# Altium schematic sheet PushButtonBlack.SchDoc
size B; DocumentNumber: 5; SheetNumber: 5; SheetTotal: 6
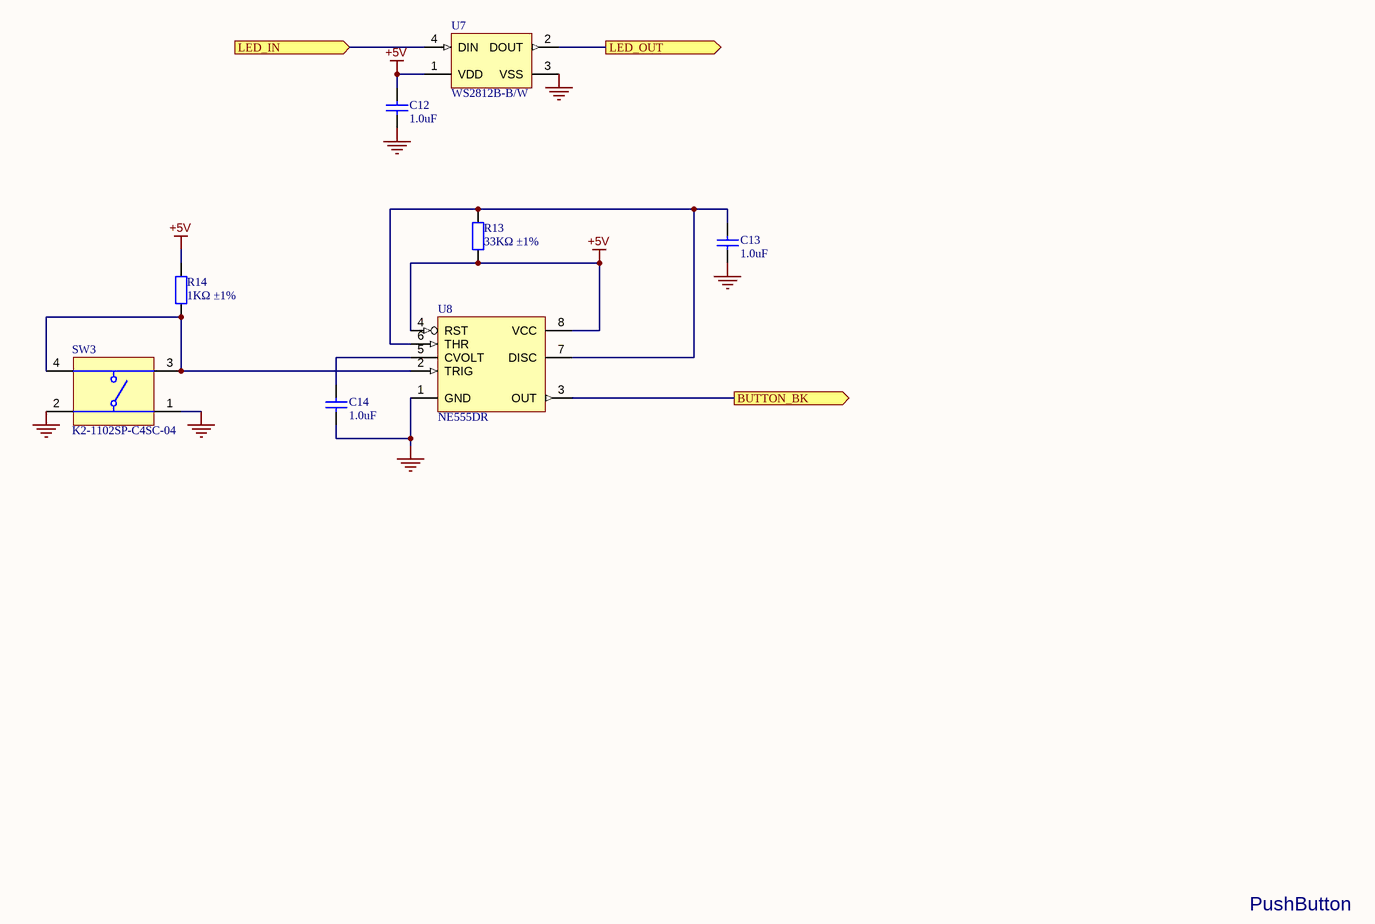
[diagram p0: PushButtonBlack.SchDoc]

## Parts
C12  1.0uF  [0402_C]
C13  1.0uF  [0402_C]
C14  1.0uF  [0402_C]
R13  33KΩ ±1%  [0402_R]
R14  1KΩ ±1%  [0402_R]
SW3  K2-1102SP-C4SC-04  [TECO-FSM4JSMATR_V]
U7  WS2812B-B/W  [ADA-RGB-1655_V]
U8  NE555DR  [SOIC-8_150mil]

## Ports
BUTTON_BK (out), LED_IN (in), LED_OUT (out)

## Nets
+5V: C12.2 R13.1 R14.1 U7.1(VDD) U8.4(RST) U8.8(VCC)
GND: C12.1 C13.1 C14.2 SW3.1 SW3.2 U7.3(VSS) U8.1(GND)
BUTTON_BK: U8.3(OUT) ; port BUTTON_BK
LED_IN: U7.4(DIN) ; port LED_IN
LED_OUT: U7.2(DOUT) ; port LED_OUT
NetC13_2: C13.2 R13.2 U8.6(THR) U8.7(DISC)
NetC14_1: C14.1 U8.5(CVOLT)
NetR14_2: R14.2 SW3.3 SW3.4 U8.2(TRIG)

## Notes on the sheet
- PushButton
- SHEET
- Expatria Technologies
- 1136 Glade Court
- Port Coquitlam, BC V3B 1R5
- PROJECT
- SIZE
- ENGR
- MODIFIED
- DOCUMENT
- REV
- Copyright Expatria Technologies 2021.  This document describes Open Hardware and is licensed under the CERN-OHL-P  v2.  No warranty is implied or expressed.
- EMAIL: INFO@EXPATRIA.CA
- B
- /

## Library data of the parts
C12-C14 = 0402 1.0uF (105) 10% 25V: Chip capacitor; Manufacturer: Samsung Electro-Mechanics; PartNumber: CL05A105KA5NQNC; Capacitance: 1uF; Tolerance: 10%; Voltage: 25V; ComponentLink1Description: Supplier link; ComponentLink1URL: http://www.szlcsc.com/product/details_53938.html; Package: 0402; Supplier: LC; SuppliersPartNumber: C52923
R13 = 0402 33K (3302) 1%: Chip resistor; Manufacturer: Uniroyal Elec; PartNumber: 0402WGF3302TCE; Power: 1/16W; ComponentLink1Description: Supplier link; ComponentLink1URL: http://www.szlcsc.com/product/details_26522.html; Package: 0402; Supplier: LC; SuppliersPartNumber: C25779; Resistance: 33KΩ; Tolerance: 1%
R14 = 0402 1K (1001) 1%: Chip resistor; Manufacturer: Uniroyal Elec; PartNumber: 0402WGF1001TCE; Power: 1/16W; ComponentLink1Description: Supplier link; ComponentLink1URL: http://www.szlcsc.com/product/details_12256.html; Package: 0402; Supplier: LC; SuppliersPartNumber: C11702; Resistance: 1KΩ; Tolerance: 1%
SW3 = CMP-2000-07486-1: Top Actuated 50mA @ 12VDC Round Button SPST 6*6mm Tactile Switches ROHS; SuppliersPartNumber: C127509; Package: SMD-4_6.0x6.0x4.5P
U7 = CMP-2000-05026-1: Intelligent Control LED Integrated Light Source, 3.5 to 5.3 V, -25 to 80 degC, 4-Pin SMD, RoHS, Tape and Reel; Manufacturer: Worldsemi; Package Description: 4-Pin Surface Mount Device, Body 5 x 5 mm; SuppliersPartNumber: C2761795; Part_Number: WS2812B-B/W
U8 = NE555DR_[C7593]: 时基集成; ComponentLink1Description: 供应商链接; ComponentLink1URL: http://www.szlcsc.com/product/details_8070.html; Package: SOIC-8_150mil; Supplier: LC; SuppliersPartNumber: C7593